# EAGLE design PDB_MH (EAGLE 7.6.0)

## Sheet 1 of 2
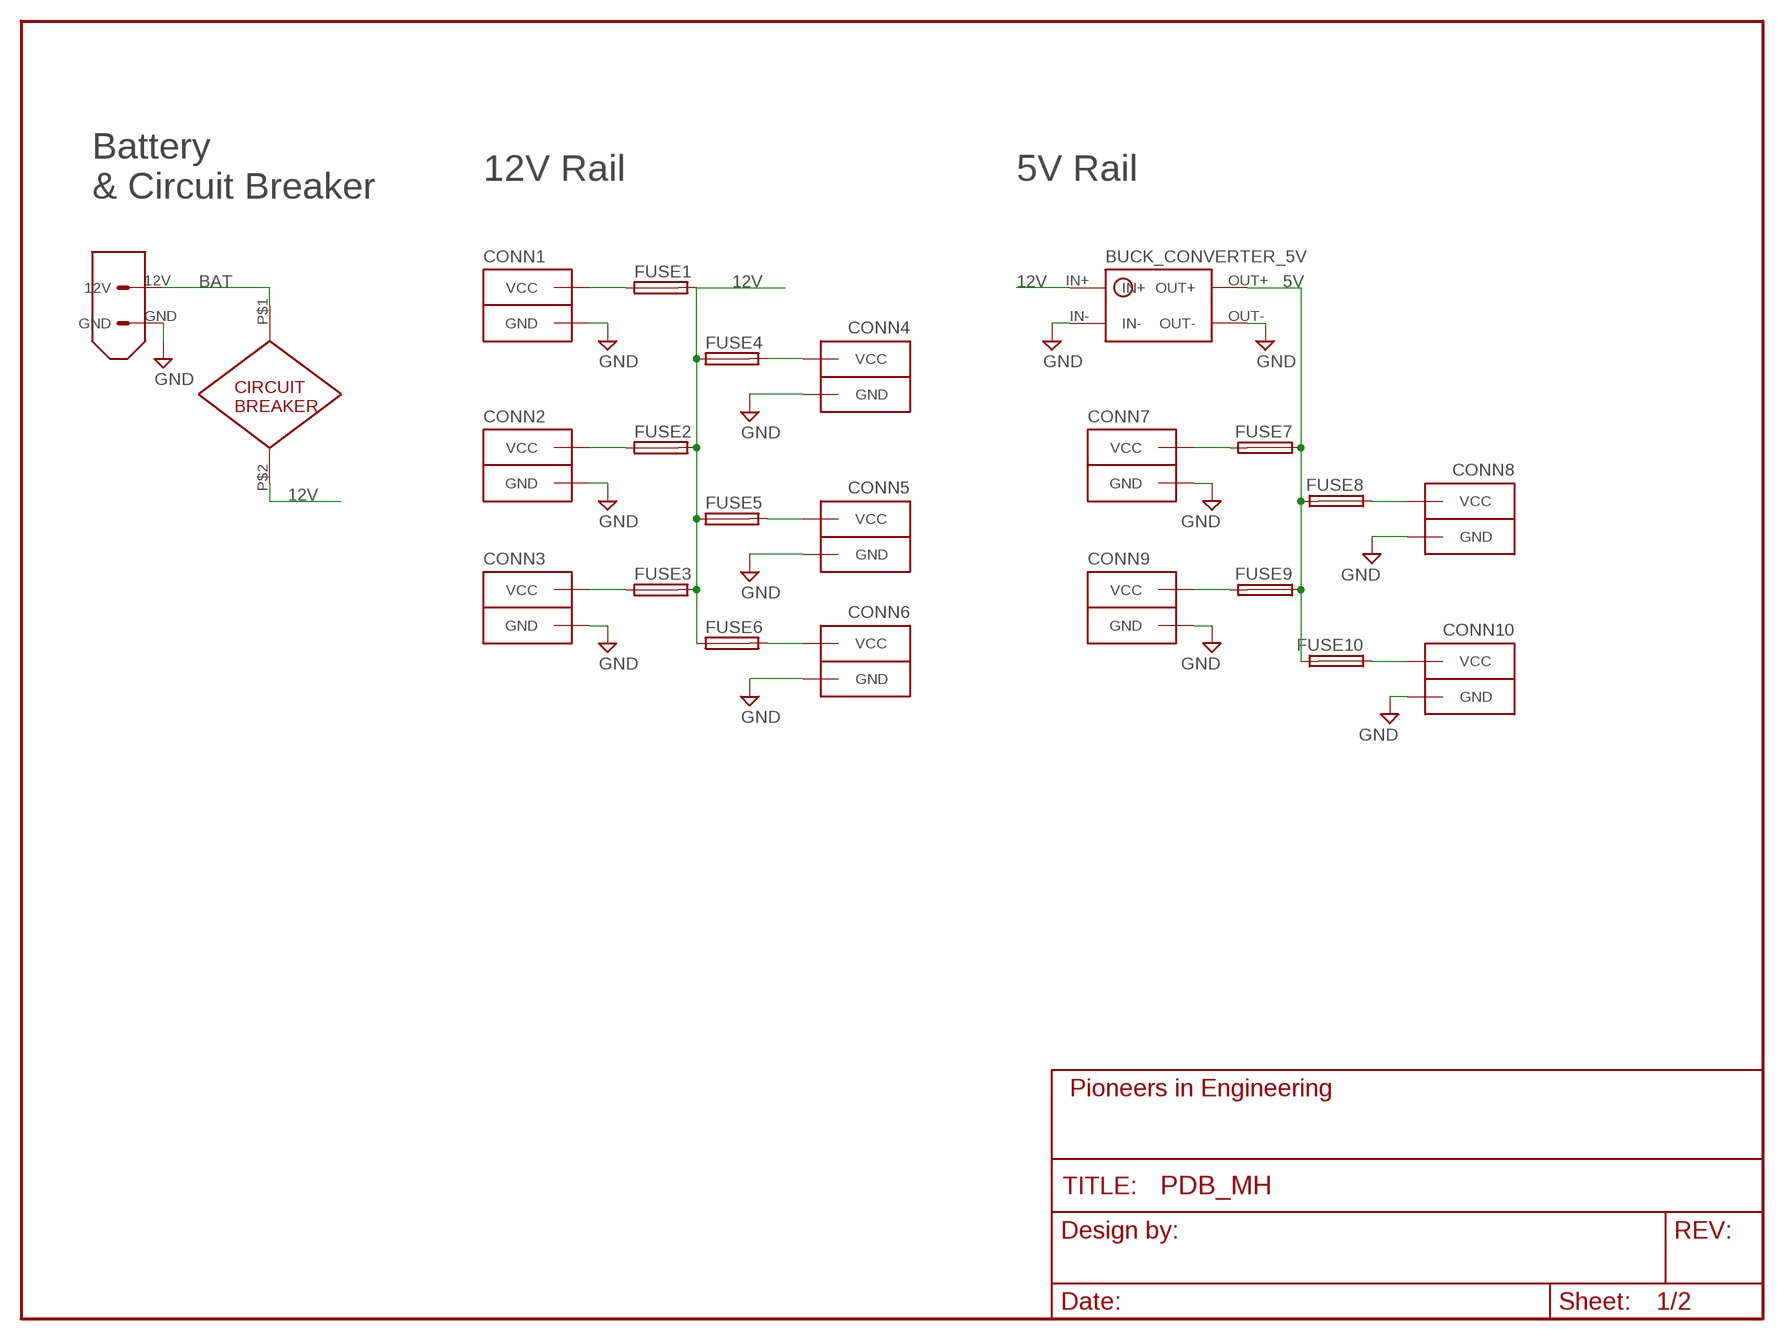
[diagram p0: schematic, sheet 1]
FRAME1 (FRAME-LETTER): AUTHOR: Mohammed H., Sharabesh R., Tobin H.; REVISION: B

### Parts
CIRCUIT_BREAKER  CIRC_BREAKER  [CIRC_BREAKER]
CONN1  ANDERSONVERTICAL  [ANDERSON_VERTICAL]
CONN2  ANDERSONVERTICAL  [ANDERSON_VERTICAL]
CONN3  ANDERSONVERTICAL  [ANDERSON_VERTICAL]
CONN4  ANDERSONVERTICAL  [ANDERSON_VERTICAL]
CONN5  ANDERSONVERTICAL  [ANDERSON_VERTICAL]
CONN6  ANDERSONVERTICAL  [ANDERSON_VERTICAL]
CONN7  ANDERSONVERTICAL  [ANDERSON_VERTICAL]
CONN8  ANDERSONVERTICAL  [ANDERSON_VERTICAL]
CONN9  ANDERSONVERTICAL  [ANDERSON_VERTICAL]
CONN10  ANDERSONVERTICAL  [ANDERSON_VERTICAL]
FUSE1  FUSE_HOLDER_SMD  [FUSE_HOLDER_SMD]
FUSE2  FUSE_HOLDER_SMD  [FUSE_HOLDER_SMD]
FUSE3  FUSE_HOLDER_SMD  [FUSE_HOLDER_SMD]
FUSE4  FUSE_HOLDER_SMD  [FUSE_HOLDER_SMD]
FUSE5  FUSE_HOLDER_SMD  [FUSE_HOLDER_SMD]
FUSE6  FUSE_HOLDER_SMD  [FUSE_HOLDER_SMD]
FUSE7  FUSE_HOLDER_SMD  [FUSE_HOLDER_SMD]
FUSE8  FUSE_HOLDER_SMD  [FUSE_HOLDER_SMD]
FUSE9  FUSE_HOLDER_SMD  [FUSE_HOLDER_SMD]
FUSE10  FUSE_HOLDER_SMD  [FUSE_HOLDER_SMD]
U$7  BUCK_CONVERTER_5V  [BUCK_CONVERTER_5V]
XT60  XT60CONNECTOR  [XT60CONNECTOR]

### Nets
5V: FUSE7.P$1_DOWN FUSE7.P$1_UP FUSE8.P$2_DOWN FUSE8.P$2_UP FUSE9.P$1_DOWN FUSE9.P$1_UP FUSE10.P$2_DOWN FUSE10.P$2_UP U$7.OUT+ ; also sheet 2
12V: CIRCUIT_BREAKER.P$2 FUSE1.P$2_DOWN FUSE1.P$2_UP FUSE2.P$2_DOWN FUSE2.P$2_UP FUSE3.P$2_DOWN FUSE3.P$2_UP FUSE4.P$1_DOWN FUSE4.P$1_UP FUSE5.P$1_DOWN FUSE5.P$1_UP FUSE6.P$1_DOWN FUSE6.P$1_UP U$7.IN+
BAT: CIRCUIT_BREAKER.P$1 XT60.12V
GND: CONN1.PIN1(GND) CONN2.PIN1(GND) CONN3.PIN1(GND) CONN4.PIN1(GND) CONN5.PIN1(GND) CONN6.PIN1(GND) CONN7.PIN1(GND) CONN8.PIN1(GND) CONN9.PIN1(GND) CONN10.PIN1(GND) U$7.IN- U$7.OUT- XT60.GND ; also sheet 2
VOUT1: CONN1.PIN2(VCC) FUSE1.P$1_DOWN FUSE1.P$1_UP
VOUT2: CONN2.PIN2(VCC) FUSE2.P$1_DOWN FUSE2.P$1_UP
VOUT3: CONN3.PIN2(VCC) FUSE3.P$1_DOWN FUSE3.P$1_UP
VOUT4: CONN4.PIN2(VCC) FUSE4.P$2_DOWN FUSE4.P$2_UP
VOUT5: CONN5.PIN2(VCC) FUSE5.P$2_DOWN FUSE5.P$2_UP
VOUT6: CONN6.PIN2(VCC) FUSE6.P$2_DOWN FUSE6.P$2_UP
VOUT7: CONN7.PIN2(VCC) FUSE7.P$2_DOWN FUSE7.P$2_UP
VOUT8: CONN8.PIN2(VCC) FUSE8.P$1_DOWN FUSE8.P$1_UP
VOUT9: CONN9.PIN2(VCC) FUSE9.P$2_DOWN FUSE9.P$2_UP
VOUT10: CONN10.PIN2(VCC) FUSE10.P$1_DOWN FUSE10.P$1_UP

### Notes on the sheet
- 12V Rail | 5V Rail
- Battery
  & Circuit Breaker

## Sheet 2 of 2
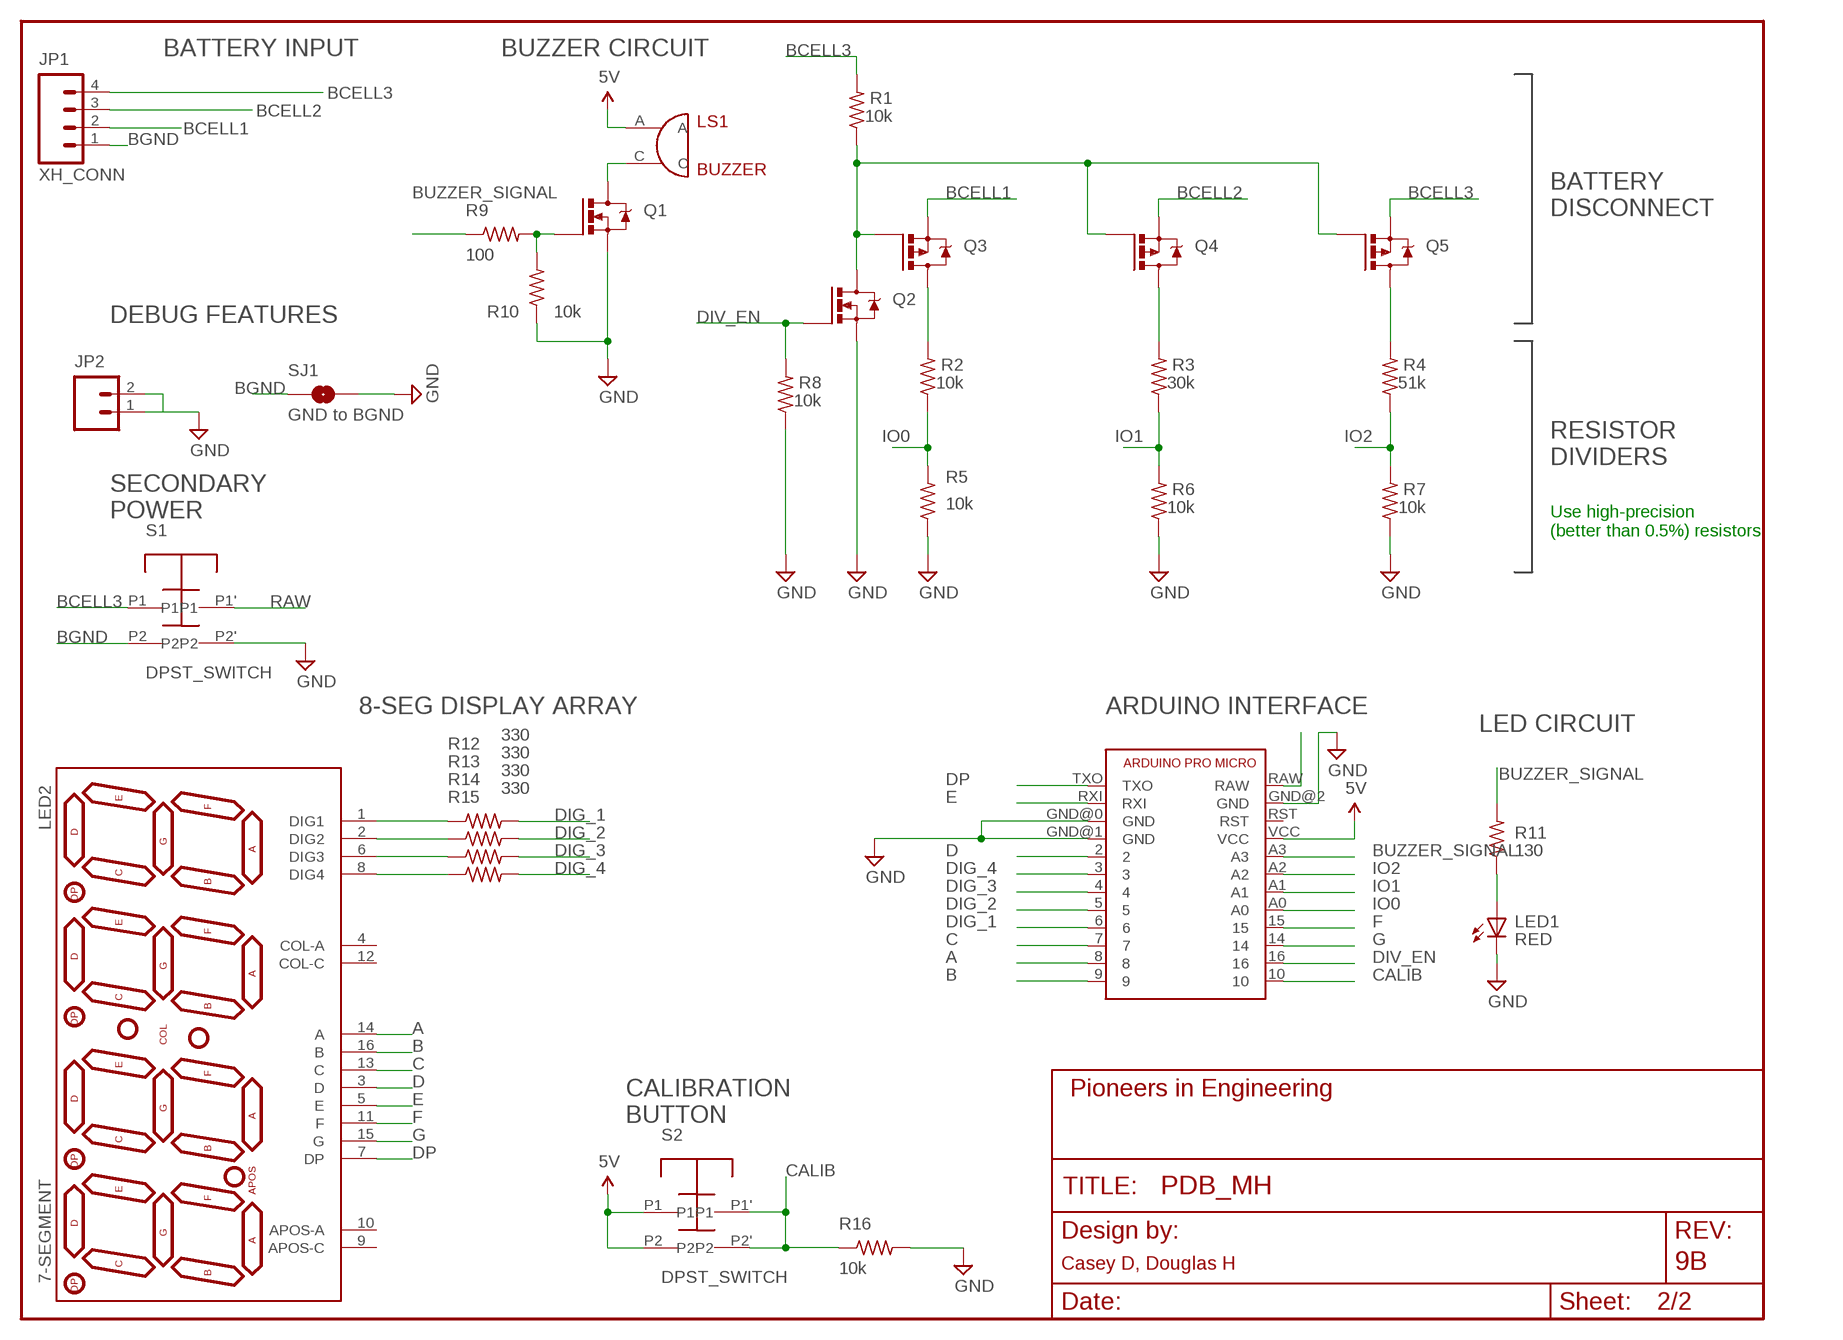
[diagram p1: schematic, sheet 2]
FRAME2 (FRAME-LETTER): AUTHOR: Casey D, Douglas H; REVISION: 9B

### Parts
JP1  XH_CONN  XH_CONNECTOR_4POS  [XH_CONNECTOR_4POS_2.5MM]
JP2  M02PTH  [1X02]
LED1  RED  LED0805  [LED-0805]
LED2  7-SEGMENT  7-SEGMENT-4DIGIT-YOUNGSUN  [7-SEGMENT-4DIGIT-YOUNGSUN]
LS1  BUZZER  [BUZZER_MAGNETIC_5V_12MM_RADIAL]
Q1  IRFML8244  N-CHANNEL-MOSFETSOT23-3  [SOT23-3]
Q2  IRFML8244  N-CHANNEL-MOSFETSOT23-3  [SOT23-3]
Q3  PMOSFET  P-CHANNEL-MOSFETSOT23-3  [SOT23-3]
Q4  P-CHANNEL-MOSFETSOT23-3  [SOT23-3]
Q5  P-CHANNEL-MOSFETSOT23-3  [SOT23-3]
R1  10k  R-US_R0603  [R0603]
R2  10k  R-US_R0603  [R0603]
R3  30k  R-US_R0603  [R0603]
R4  51k  R-US_R0603  [R0603]
R5  10k  R-US_R0603  [R0603]
R6  10k  R-US_R0603  [R0603]
R7  10k  R-US_R0603  [R0603]
R8  10k  R-US_R0603  [R0603]
R9  100  R-US_R0603  [R0603]
R10  10k  R-US_R0603  [R0603]
R11  130  R-US_R0603  [R0603]
R12  330  R-US_R0603  [R0603]
R13  330  R-US_R0603  [R0603]
R14  330  R-US_R0603  [R0603]
R15  330  R-US_R0603  [R0603]
R16  10k  R-US_R0603  [R0603]
S1  DPST_SWITCH  [C&K_SWITCH]
S2  DPST_SWITCH  [C&K_SWITCH]
SJ1  GND to BGND  SOLDERJUMPERNO  [SJ_2S-NO]
UC1  ARDUINO_PRO_MICRO  [ARDUINO_PRO_MICRO]

### Nets
5V: LS1.A S2.P1 S2.P2 UC1.VCC ; also sheet 1
A: LED2.14(A) UC1.8
B: LED2.16(B) UC1.9
BCELL1: JP1.2 Q3.2(S)
BCELL2: JP1.3 Q4.2(S)
BCELL3: JP1.4 Q5.2(S) R1.2 S1.P1
BGND: JP1.1 S1.P2 SJ1.1
BUZZER_SIGNAL: R9.1 R11.2 UC1.A3
C: LED2.13(C) UC1.7
CALIB: R16.1 S2.P1' S2.P2' UC1.10
D: LED2.3(D) UC1.2
DIG_1: R12.2 UC1.6
DIG_2: R13.2 UC1.5
DIG_3: R14.2 UC1.4
DIG_4: R15.2 UC1.3
DIV_EN: Q2.1(G) R8.2 UC1.16
DP: LED2.7(DP) UC1.TXO
E: LED2.5(E) UC1.RXI
F: LED2.11(F) UC1.15
G: LED2.15(G) UC1.14
GND: JP2.1 JP2.2 LED1.C Q1.2(S) Q2.2(S) R5.1 R6.1 R7.1 R8.1 R10.1 R16.2 S1.P2' SJ1.2 UC1.GND@0(GND) UC1.GND@1(GND) UC1.GND@2(GND) ; also sheet 1
IO0: R2.1 R5.2 UC1.A0
IO1: R3.1 R6.2 UC1.A1
IO2: R4.1 R7.2 UC1.A2
N$1: Q2.3(D) Q3.1(G) Q4.1(G) Q5.1(G) R1.1
N$2: Q3.3(D) R2.2
N$3: Q4.3(D) R3.2
N$4: Q5.3(D) R4.2
N$5: LS1.C Q1.3(D)
N$6: Q1.1(G) R9.2 R10.2
N$7: LED1.A R11.1
N$9: LED2.1(DIG1) R12.1
N$11: LED2.2(DIG2) R13.1
N$13: LED2.6(DIG3) R14.1
N$15: LED2.8(DIG4) R15.1
RAW: S1.P1' UC1.RAW
Unconnected: LED2.4(COL-A) LED2.9(APOS-C) LED2.10(APOS-A) LED2.12(COL-C) UC1.RST

### Notes on the sheet
- BATTERY INPUT | BUZZER CIRCUIT
- BATTERY
  DISCONNECT
- DEBUG FEATURES
- RESISTOR
  DIVIDERS
- SECONDARY
  POWER
- Use high-precision
  (better than 0.5%) resistors
- 8-SEG DISPLAY ARRAY | ARDUINO INTERFACE
- Connect BCELL3 to RAW, which
  will get regulated on the arduino.
- LED CIRCUIT
- CALIBRATION
  BUTTON

## Library data of the parts
CIRCUIT_BREAKER = pie:CIRC_BREAKER: PiE Circuit Breaker: product page <http://www.waytekwire.com/item/46977/Bussmann-25550-B-2-Mid-Range-Circuit-Breaker-/>; MANUF: WAYTEK; MANUF-PN: 46977
CONN1-CONN10 = pie:ANDERSON: 2-pin 25A Anderson Connector http://www.alliedelec.com/images/products/datasheets/bm/ANDERSON_POWER_PRODUCTS/70162018.pdf; PIE-INT-REF-NUM: Anderson
FUSE1-FUSE10 = pie:FUSE_HOLDER_SMD: ATC/ATO Fuse Holder. Original variant datasheet <http://keyelco.com/userAssets/file/M65p43.pdf> and Digikey <http://www.digikey.com/product-detail/en/keystone-electronics/3587/36-3587-ND/2137315>; DIGIKEY-PN: 36-3587-ND; MANUF: KEYSTONE; MANUF-PN: 3587
JP1 = pie:XH_CONNECTOR_4POS: 4-pin XH connector (through-hole type shrouded header); PIE-INT-REF-NUM: XH-4POS; PIE_DIGIKEY-PN: 455-2249-ND
JP2 = pie:M02: 2-pin 0.1-inch header and MTA connector; PIE-INT-REF-NUM: BULK-STOCK
LED1 = pie:LED: LEDs Standard schematic elements and footprints for 5mm, 3mm, 1206, and 0603 sized LEDs. 5mm - Spark Fun Electronics SKU : COM-00529 (and others); PIE-INT-REF-NUM: LED
LED2 = pie:7-SEGMENT-4DIGIT-YOUNGSUN: This is a part for the 4-Digit 7-segment LEDs from Young Sun. Different from the Digikey LEDs, all 16 pins are used. The LONGPADS Variant is used for a test jig, but you may like it because there is more pad to solder to. If you are concerned about routing space, the standard works just fine though.
LS1 = pie:BUZZER: Buzzer; PIE-INT-REF-NUM: BUZZER; PIE_DIGIKEY-PN: 102-1269-ND
Q1 Q2 = pie:N-CHANNEL-MOSFET: N-channel TrenchMOS (TM) logic level FET Source: SOT23-3: http://www.nxp.com/documents/data_sheet/BSS123.pdf SOT669: http://www.nxp.com/documents/data_sheet/PH7030L.pdf
Q3-Q5 = pie:P-CHANNEL-MOSFET: P-Channel PowerTrench® MOSFET Source: FDD4141.pdf; PIE-DIGIKEY-PN-PRI: IRLML6402PBFCT-ND; PIE-INT-REF-NUM: PMOS
R1-R16 = pie:R-US_: RESISTOR, American symbol; PIE-INT-REF-NUM: RESISTOR-GENERIC
S1 S2 = pie:DPST_SWITCH: Double Throw, single pole normally open pushbutton switch. 401-1133-ND
SJ1 = pie:SOLDERJUMPER: Solder Jumper Standard SMD solder jumper. Used to automate production. Two varients : Normally Open and Normally Closed are the same, but have different paste layers. NC will have a large amount of paste and should jumper during reflow.; PIE-INT-REF-NUM: DNL
U$7 = pie:BUCK_CONVERTER_5V: 5V Buck Converter. For PDB. Product Detail <https://www.amazon.com/dp/B00GQ032DK/?psc=1>
UC1 = pie:ARDUINO_PRO_MICRO: Arduino Pro Micro Electrical System Year 9's Smart Sensor Core Pin Outs <https://cdn.sparkfun.com/assets/9/c/3/c/4/523a1765757b7f5c6e8b4567.png> Buy Here <http://www.aliexpress.com/item/Mini-Leonardo-Pro-Micro-ATmega32U4-5V-16MHz-Module-For-Arduino-Best-Quality/32284746884.html?ws_ab_test=searchweb201556_8,searchweb201602_2_10057_10056_10065_10055_10054_10067_10069_10059_10058_10017_10070_10060_10061_10052_10062_10053_10050_10051,searchweb201603_1&btsid=45993952-29ca-4de4-a0fb-c7fb72b8e1a5>
XT60 = pie:XT60CONNECTOR: 12V XT60 power connector; PARTNUMBER: PRT-10474

## Board
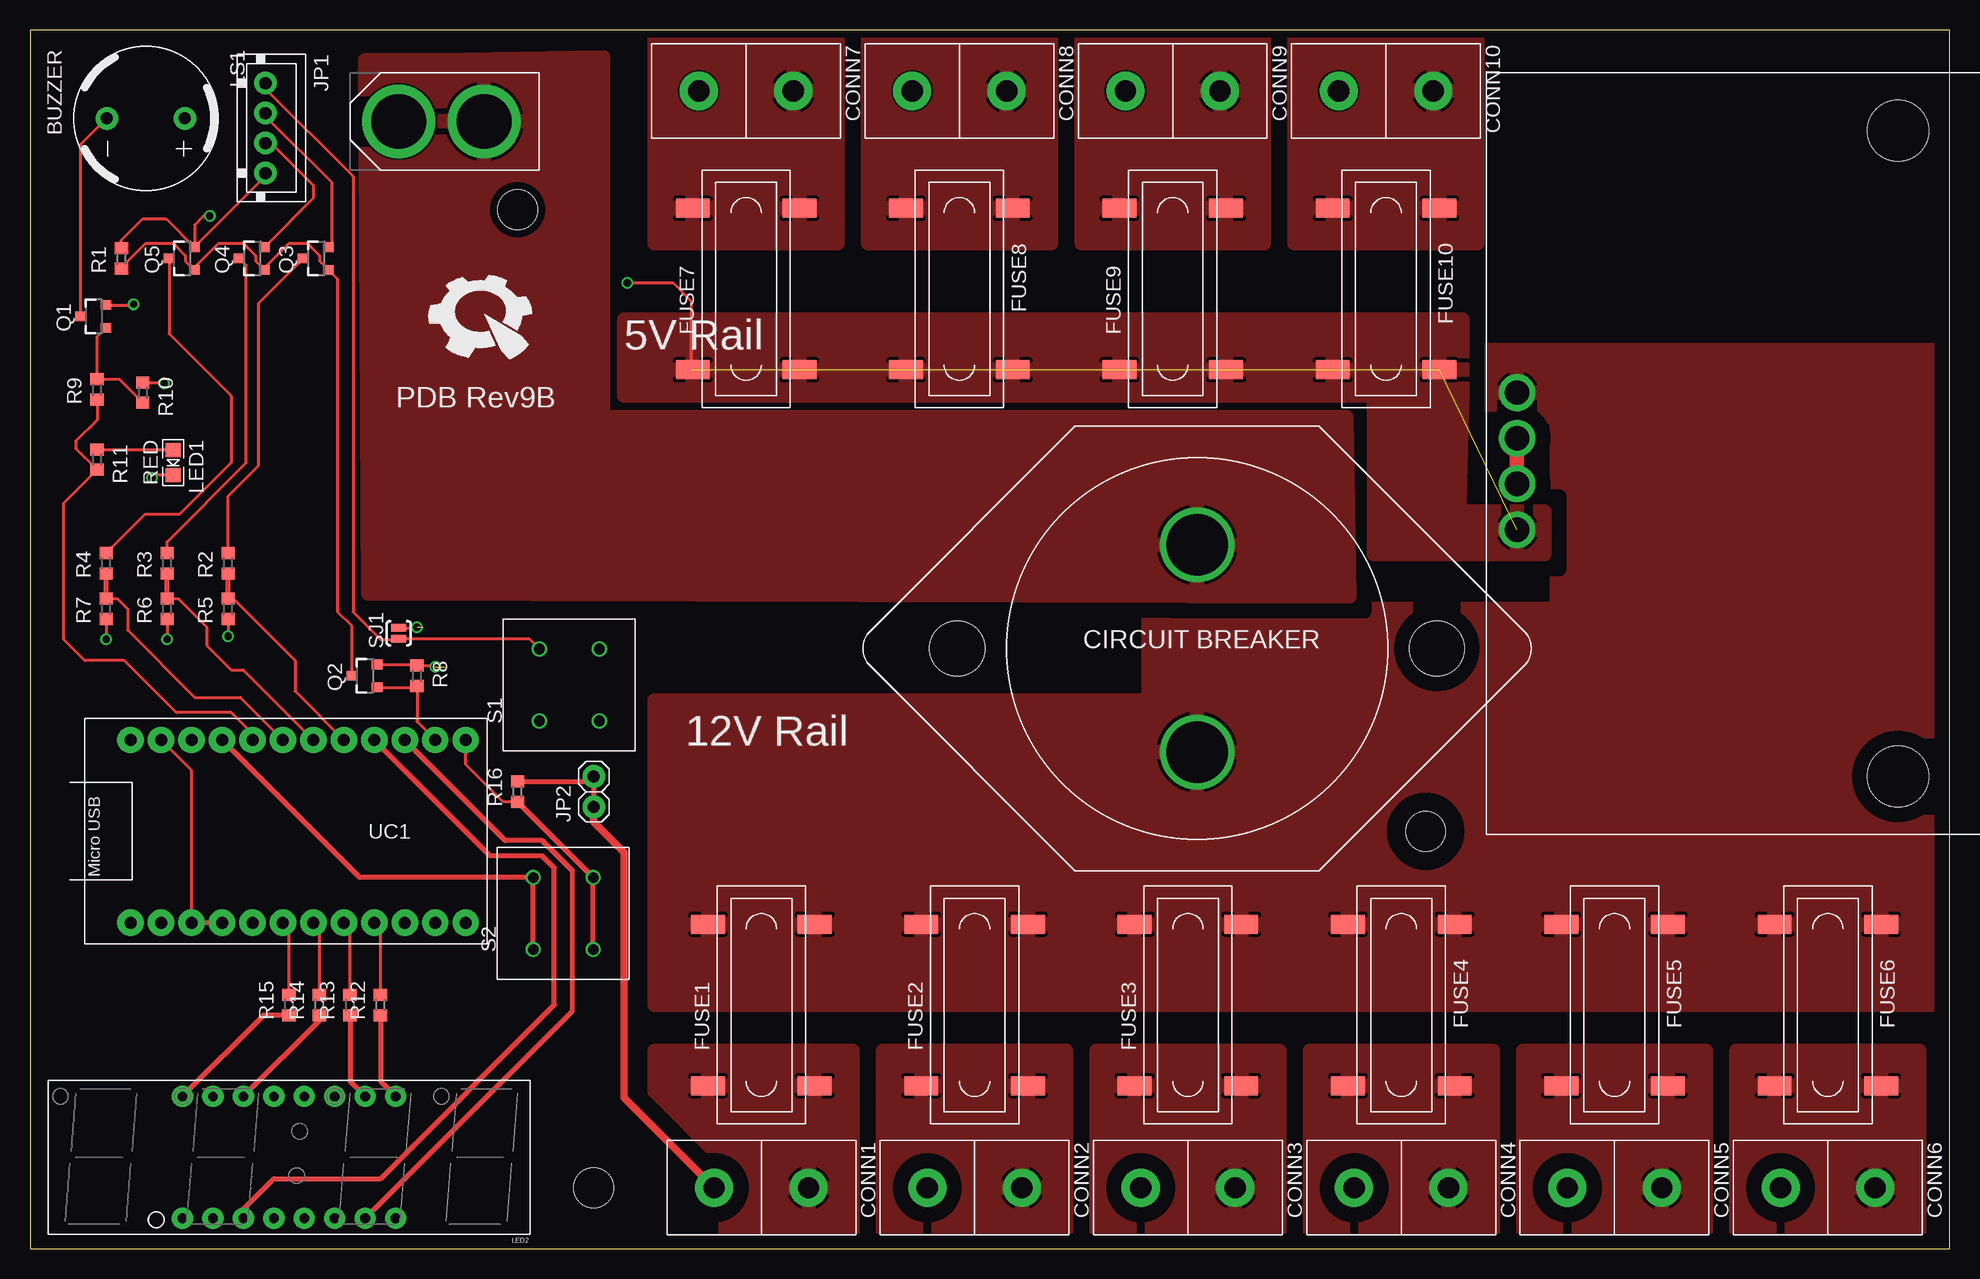
[diagram p2: board, top side]
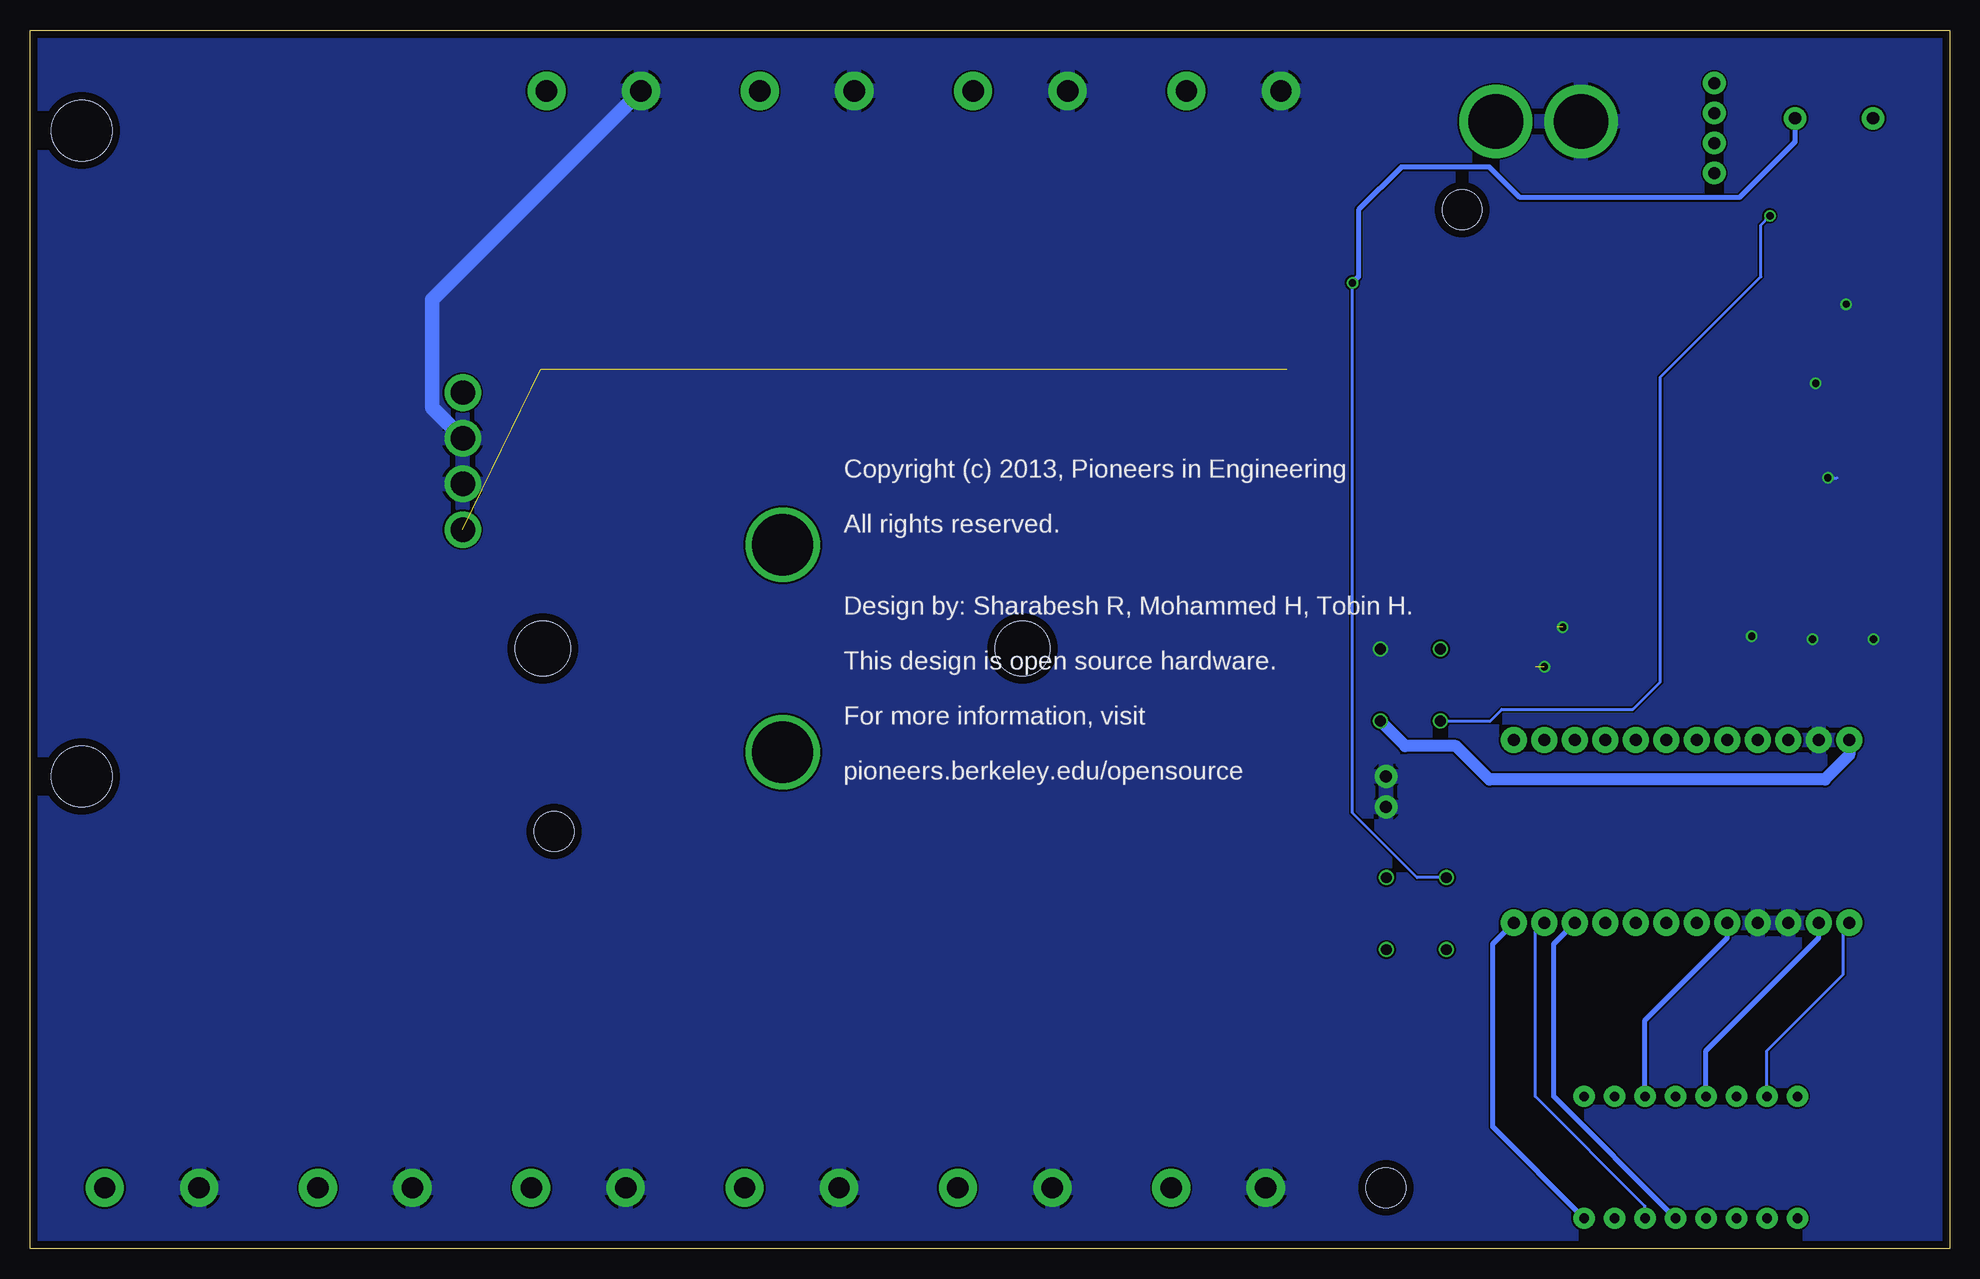
[diagram p3: board, bottom side, seen from below]

Size 160.02 x 101.6 mm. Coordinates in mm from the lower left corner, seen from the top.
Outline: 0,0 160.02,0 160.02,101.6 0,101.6 0,0
Copper layers (1*16): Top 2mil / dielectric 9mil / Bottom 2mil
Design rules "pie": minimum track width 6mil, minimum drill 15mil, track to track 6mil, track to pad 6mil, pad to pad 6mil, via to via 6mil, smd to smd 6mil, copper to edge 25mil, drill to drill 7mil, minimum pad ring 7mil, minimum via ring 7mil, stop-mask expansion 3mil, vias tented up to drill 21mil, thermal gap 10mil

### Footprints (pad centres in the part's own frame; a part is rotated, then mirrored left to right if it is on the bottom)
CIRC_BREAKER = drill 5.105 pad 6.223: P$1 0,8.636; P$2 0,-8.636 | hole 4.572: -19.99,0; 19.99,0
ANDERSON_VERTICAL = drill 1.778 pad 3.175: PIN1 0,-3.937; PIN2 0,3.937
FUSE_HOLDER_SMD = smd 1.575 x 2.819: P$1_DOWN -6.731,-4.445; P$1_UP -6.731,4.445; P$2_DOWN 6.731,-4.445; P$2_UP 6.731,4.445
XH_CONNECTOR_4POS_2.5MM = drill 1.016 pad 1.88: 1 -3.95,-0.19; 2 -1.45,-0.19; 3 1.05,-0.19; 4 3.55,-0.19
1X02 = drill 1.016 pad 1.88: 1 -1.27,0; 2 1.27,0
LED-0805 = smd 1.194 x 1.245: A -1.041,0; C 1.041,0
7-SEGMENT-4DIGIT-YOUNGSUN = drill 0.8 pad 1.778: 1 -8.89,-5.08; 2 -6.35,-5.08; 3 -3.81,-5.08; 4 -1.27,-5.08; 5 1.27,-5.08; 6 3.81,-5.08; 7 6.35,-5.08; 8 8.89,-5.08; 9 8.89,5.08; 10 6.35,5.08; 11 3.81,5.08; 12 1.27,5.08; 13 -1.27,5.08; 14 -3.81,5.08; 15 -6.35,5.08; 16 -8.89,5.08
BUZZER_MAGNETIC_5V_12MM_RADIAL = drill 1.016 pad 1.88: A 0,3.25; C 0,-3.25
SOT23-3 = smd 0.8 x 0.9: 1 -0.95,-1; 2 0.95,-1; 3 0,1.1
R0603 = smd 1 x 1.1: 1 -0.85,0; 2 0.85,0
C&K_SWITCH = drill 0.9: P1 -3,2.5; P1' -3,-2.5; P2 3,2.5; P2' 3,-2.5
SJ_2S-NO = smd 0.635 x 1.27: 1 -0.45,0; 2 0.45,0
STAND-OFF = hole 3.302: 0,0
BUCK_CONVERTER_5V = drill 2.032 pad 3.048: IN+ 5.08,31.75; IN- 1.27,31.75; OUT+ -6.35,31.75; OUT- -2.54,31.75 | hole 5.08: -26.924,0; 26.924,0
ARDUINO_PRO_MICRO = drill 1 pad 2.184: 2 1.778,19.558; 3 1.778,17.018; 4 1.778,14.478; 5 1.778,11.938; 6 1.778,9.398; 7 1.778,6.858; 8 1.778,4.318; 9 1.778,1.778; 10 17.018,1.778; 14 17.018,6.858; 15 17.018,9.398; 16 17.018,4.318; A0 17.018,11.938; A1 17.018,14.478; A2 17.018,17.018; A3 17.018,19.558; GND@0 1.778,24.638; GND@1 1.778,22.098; GND@2 17.018,27.178; RAW 17.018,29.718; RST 17.018,24.638; RXI 1.778,27.178; TXO 1.778,29.718; VCC 17.018,22.098
XT60CONNECTOR = drill 4.572 pad 6.096: 12V -3.556,0; GND 3.556,0

### Placement (x,y rotation side)
CIRCUIT_BREAKER  97.28,50.04 0 top
CONN1  60.96,5.08 270 top
CONN2  78.74,5.08 270 top
CONN3  96.52,5.08 270 top
CONN4  114.3,5.08 270 top
CONN5  132.08,5.08 270 top
CONN6  149.86,5.08 270 top
CONN7  59.69,96.52 270 top
CONN8  77.47,96.52 270 top
CONN9  95.25,96.52 270 top
CONN10  113.03,96.52 270 top
FUSE1  60.96,20.32 90 top
FUSE2  78.74,20.32 90 top
FUSE3  96.52,20.32 90 top
FUSE4  114.3,20.32 270 top
FUSE5  132.08,20.32 270 top
FUSE6  149.86,20.32 270 top
FUSE7  59.69,80.01 90 top
FUSE8  77.47,80.01 270 top
FUSE9  95.25,80.01 90 top
FUSE10  113.03,80.01 270 top
JP1  19.81,93.22 270 top
JP2  46.99,38.1 90 top
LED1  11.94,65.53 270 top
LED2  21.59,7.62 180 top
LS1  9.65,94.23 270 top
Q1  5.33,77.72 90 top
Q2  27.94,47.75 90 top
Q3  23.88,82.55 90 top
Q4  18.54,82.55 90 top
Q5  12.7,82.55 90 top
R1  7.62,82.55 90 top
R2  16.51,57.15 90 top
R3  11.43,57.15 90 top
R4  6.35,57.15 90 top
R5  16.51,53.34 90 top
R6  11.43,53.34 90 top
R7  6.35,53.34 90 top
R8  32.26,47.75 270 top
R9  5.59,71.63 90 top
R10  9.4,71.37 270 top
R11  5.59,65.79 270 top
R12  29.21,20.32 90 top
R13  26.67,20.32 90 top
R14  24.13,20.32 90 top
R15  21.59,20.32 90 top
R16  40.64,38.1 90 top
S1  44.96,46.99 90 top
S2  44.45,27.94 90 top
SJ1  30.73,51.31 90 top
U$2  [STAND-OFF]  46.99,5.08 0 top
U$3  [STAND-OFF]  10.16,129.54 0 bottom  (outside the outline)
U$4  [STAND-OFF]  116.33,34.8 90 top
U$5  [STAND-OFF]  40.64,86.61 0 top
U$6  [PIE-LOGO-SMALL]  37.85,77.98 0 top
U$7  155.7,66.29 90 top
UC1  38.1,25.4 90 top
XT60  34.29,93.98 180 top

### Tracks (layer width: path | path; a pad name or v marks a point on that pad's centre or on a via)
5V  (via drill 0.6)  (8 unrouted)
  Top 0.254: v49.78,80.52 53.59,80.52 55.12,78.99 55.12,73.41 FUSE7.P$1_UP
  Top 0.406: S2.P1 S2.P2 27.48,30.94 UC1.VCC
  Bottom 0.254: S2.P2 44.4,30.94 49.78,36.32 v49.78,80.52
  Bottom 0.406: LS1.A 12.9,92.25 17.53,87.63 35.81,87.63 38.35,90.17 45.72,90.17 49.28,86.61 49.28,81.03 v49.78,80.52
  pour Top: 49.53,77.47 119.38,77.47 119.38,71.12 119.13,62.23 119.13,61.47 126.24,61.47 126.24,57.91 112.01,57.91 112.01,71.12 49.53,71.12
12V
  pour Top (isolate 1.27, rank 2): 52.07,45.72 93.22,45.72 93.22,53.34 127.25,53.34 127.25,69.34 120.9,69.34 120.9,74.93 158.75,74.93 158.75,20.32 52.07,20.32
A
  Bottom 0.254: LED2.14 25.4,3.56 34.54,12.7 34.54,26.42 UC1.8
B
  Bottom 0.406: LED2.16 38.1,10.16 38.1,25.4 UC1.9
BAT
  pour Top: 47.75,99.31 47.75,69.34 109.73,69.34 109.98,54.36 28.19,54.61 27.94,99.06 34.04,99.06
BCELL1
  Top 0.254: JP1.2 19.62,94.42 25.15,88.9 25.15,83.77 Q3.2
BCELL2
  Top 0.254: JP1.3 20.1,92.17 23.62,88.65 23.62,87.58 Q4.2
BCELL3  (via drill 0.6)
  Top 0.254: JP1.4 19.62,89.42 Q5.2 | R1.2 7.62,84.07 9.4,85.85 11.35,85.85 Q5.2 | v14.99,86.11 14.48,86.11 13.72,85.34 13.72,83.52 Q5.2
  Bottom 0.254: S1.P1 38.31,43.99 37.34,44.96 26.42,44.96 24.13,47.24 24.13,72.64 15.75,81.03 15.75,85.34 v14.99,86.11
BGND
  Top 0.254: S1.P2 41.59,50.86 SJ1.1 30.68,50.8 29.21,50.8 26.92,53.09 26.92,89.41 19.62,96.71 JP1.1
BUZZER_SIGNAL
  Top 0.254: R9.1 5.59,69.09 3.81,67.31 3.81,66.71 R11.2 2.79,62.14 2.79,50.8 4.57,49.02 7.87,49.02 12.19,44.7 16.76,44.7 18.54,42.93 UC1.A3
C
  Bottom 0.406: LED2.13 33.02,12.7 33.02,25.4 UC1.7
CALIB
  Top 0.254: R16.1 39.46,37.25 36.32,40.39 UC1.10
  Top 0.406: S2.P1' S2.P2' R16.1
D
  Bottom 0.406: LED2.3 25.4,19.05 18.54,25.91 UC1.2
DIG_1
  Top 0.254: R12.2 29.21,26.67 UC1.6
DIG_2
  Top 0.254: R13.2 26.67,26.67 UC1.5
DIG_3
  Top 0.254: R14.2 24.13,26.67 UC1.4
DIG_4
  Top 0.254: R15.2 21.59,26.67 UC1.3
DIV_EN
  Top 0.254: Q2.1 32.16,46.8 R8.2 32.26,43.94 UC1.16
DP
  Bottom 0.254: LED2.7 15.24,16.51 8.89,22.86 8.89,26.67 UC1.TXO
E
  Bottom 0.406: LED2.5 20.32,16.51 10.92,25.91 UC1.RXI
F
  Top 0.406: LED2.11 17.78,3.3 20.32,5.84 29.21,5.84 43.69,20.32 43.69,31.75 42.67,32.77 38.35,32.77 UC1.15
G
  Top 0.406: LED2.15 45.21,19.81 45.21,31.5 42.67,34.04 39.62,34.04 UC1.14
GND  (via drill 0.6)  (2 unrouted)
  Top 0.254: UC1.GND@0 13.46,39.88 UC1.GND@2 | Q1.2 8.57,78.67 v8.64,78.74 | R10.1 11.09,72.22 v11.18,72.14 | LED1.C 10.39,64.49 v10.16,64.26 | R7.1 v6.35,50.8 | R6.1 v11.43,50.8 | R5.1 v16.51,51.05 | SJ1.2 32.2,51.76 v32.26,51.82 | Q2.2 32.16,48.7 R8.1 33.69,48.6 v33.78,48.51
  Top 0.406: JP2.1 JP2.2 46.57,38.95 R16.2 | UC1.GND@1 UC1.GND@0
  Top 0.635: JP2.1 46.99,35.56 49.53,33.02 49.53,12.57 CONN1.PIN1
  Top 1.194: U$7.OUT- U$7.IN-
  Bottom 0.254: v10.16,64.26 9.4,64.26
  Bottom 1.194: 123.7,67.31 U$7.IN- 126.49,70.1 126.49,79.12 CONN10.PIN1
  pour Bottom (rank 6): 0,101.6 160.02,101.6 160.02,0 0,0
IO0
  Top 0.254: R5.2 16.93,54.19 22.1,49.02 22.1,46.48 UC1.A0
  Top 0.406: R5.2 R2.1
IO1
  Top 0.254: R6.2 12.36,54.19 14.73,51.82 14.73,50.29 16.76,48.26 17.78,48.26 UC1.A1
  Top 0.406: R6.2 R3.1
IO2
  Top 0.254: R7.2 7.28,54.19 8.13,53.34 8.13,51.56 13.72,45.97 17.53,45.97 UC1.A2
  Top 0.406: R7.2 R4.1
N$1
  Top 0.254: Q2.3 26.84,51.9 25.65,53.09 25.65,80.82 Q3.1 24.13,82.35 24.13,82.8 23.11,83.82 21.59,83.82 19.54,81.77 Q4.1 18.8,82.35 18.8,82.8 17.78,83.82 15.75,83.82 13.7,81.77 Q5.1 12.95,82.35 12.95,82.8 11.94,83.82 9.65,83.82 7.62,81.79 R1.1
N$2
  Top 0.254: R2.2 16.51,62.74 19.05,65.28 19.05,78.82 Q3.3
N$3
  Top 0.254: R3.2 11.43,58.93 18.03,65.53 18.03,81.96 Q4.3
N$4
  Top 0.254: Q5.3 11.6,76.28 16.76,71.12 16.76,65.53 12.45,61.21 9.56,61.21 R4.2
N$5
  Top 0.254: Q1.3 4.23,92.07 LS1.C
N$6
  Top 0.254: Q1.1 5.59,76.03 R9.2 7.44,72.48 R10.2
N$7
  Top 0.254: R11.1 11.88,66.64 LED1.A
N$9
  Top 0.406: R12.1 29.21,13.97 LED2.1
N$11
  Top 0.406: R13.1 26.67,13.97 LED2.2
N$13
  Top 0.406: R14.1 24.13,19.05 LED2.6
N$15
  Top 0.406: R15.1 19.47,19.47 LED2.8
RAW
  Bottom 1.016: UC1.RAW 8.38,41.15 10.41,39.12 38.35,39.12 41.15,41.91 45.38,41.91 S1.P1'
VOUT1
  pour Top (isolate 1.27): 52.07,16.51 68.58,16.51 68.58,1.27 52.07,1.27
VOUT2
  pour Top (isolate 1.27): 71.12,16.51 86.36,16.51 86.36,1.27 71.12,1.27
VOUT3
  pour Top (isolate 1.27): 88.9,16.51 104.14,16.51 104.14,1.27 88.9,1.27
VOUT4
  pour Top (isolate 1.27): 106.68,1.27 121.92,1.27 121.92,16.51 106.68,16.51
VOUT5
  pour Top (isolate 1.27): 124.46,1.27 139.7,1.27 139.7,16.51 124.46,16.51
VOUT6
  pour Top (isolate 1.27): 142.24,1.27 157.48,1.27 157.48,16.51 142.24,16.51
VOUT7
  pour Top: 52.07,101.6 67.31,101.6 67.31,83.82 52.07,83.82
VOUT8
  pour Top: 69.85,101.6 69.85,83.82 85.09,83.82 85.09,101.6
VOUT9
  pour Top: 87.63,101.6 87.63,83.82 102.87,83.82 102.87,101.6
VOUT10
  pour Top: 105.41,101.6 105.41,83.82 120.65,83.82 120.65,101.6

### Text on the board
tPlace: 5V Rail | PDB Rev9B | 12V Rail
bPlace: Copyright (c) 2013, Pioneers in Engineering / / All rights reserved. / / / Design by: Sharabesh R, Mohammed H, Tobin H. / / This design is open source hardware. / / For more information, visit / / pioneers.berkeley.edu/opensource